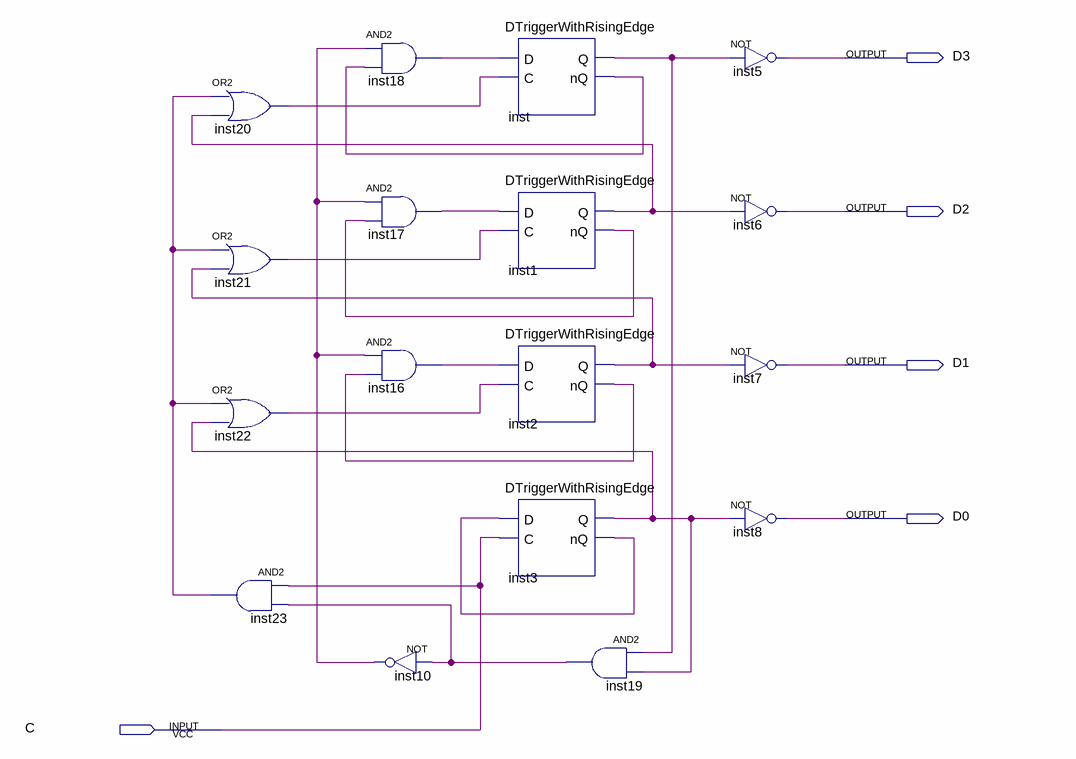
[diagram p0: schematic sheet]
// Quartus schematic Count10.bdf as structural Verilog: 17 symbols, 5 pins
module Count10 (
  input  C,
  output D3,
  output D2,
  output D1,
  output D0
);

  wire inst1_nq, inst1_q, inst2_nq, inst2_q, inst3_nq, inst3_q, inst10_out, inst16_out, inst17_out,
       inst18_out, inst19_out, inst20_out, inst21_out, inst22_out, inst23_out, inst_nq, inst_q;

  or inst20 (inst20_out, inst23_out, inst1_q);
  or inst21 (inst21_out, inst23_out, inst2_q);
  or inst22 (inst22_out, inst23_out, inst3_q);
  and inst23 (inst23_out, C, inst19_out);
  and inst18 (inst18_out, inst10_out, inst_nq);
  and inst17 (inst17_out, inst10_out, inst1_nq);
  and inst16 (inst16_out, inst10_out, inst2_nq);
  not inst10 (inst10_out, inst19_out);
  DTriggerWithRisingEdge inst (.D(inst18_out), .C(inst20_out), .Q(inst_q), .nQ(inst_nq));
  DTriggerWithRisingEdge inst1 (.D(inst17_out), .C(inst21_out), .Q(inst1_q), .nQ(inst1_nq));
  DTriggerWithRisingEdge inst2 (.D(inst16_out), .C(inst22_out), .Q(inst2_q), .nQ(inst2_nq));
  DTriggerWithRisingEdge inst3 (.D(inst3_nq), .C(C), .Q(inst3_q), .nQ(inst3_nq));
  and inst19 (inst19_out, inst_q, inst3_q);
  not inst5 (D3, inst_q);
  not inst6 (D2, inst1_q);
  not inst7 (D1, inst2_q);
  not inst8 (D0, inst3_q);
endmodule
